# Altium schematic sheet pca10040_sheet5_buttons_and_leds.SchDoc: PCA10040 - Buttons and LEDs
size A4; Organization: Nordic Semiconductor; DocumentNumber: 5; Revision: 1.2.1; SheetNumber: 5; SheetTotal: 7; CompanyName: Nordic Semiconductor; DrawnBy: KJP/RUBR; ProjectNumber: 4397; PCBRevision: 0256RUBR; DocumentSize: A4; PCAName: PCA10040; PCBNumber: 400150; ProjectName: Quark
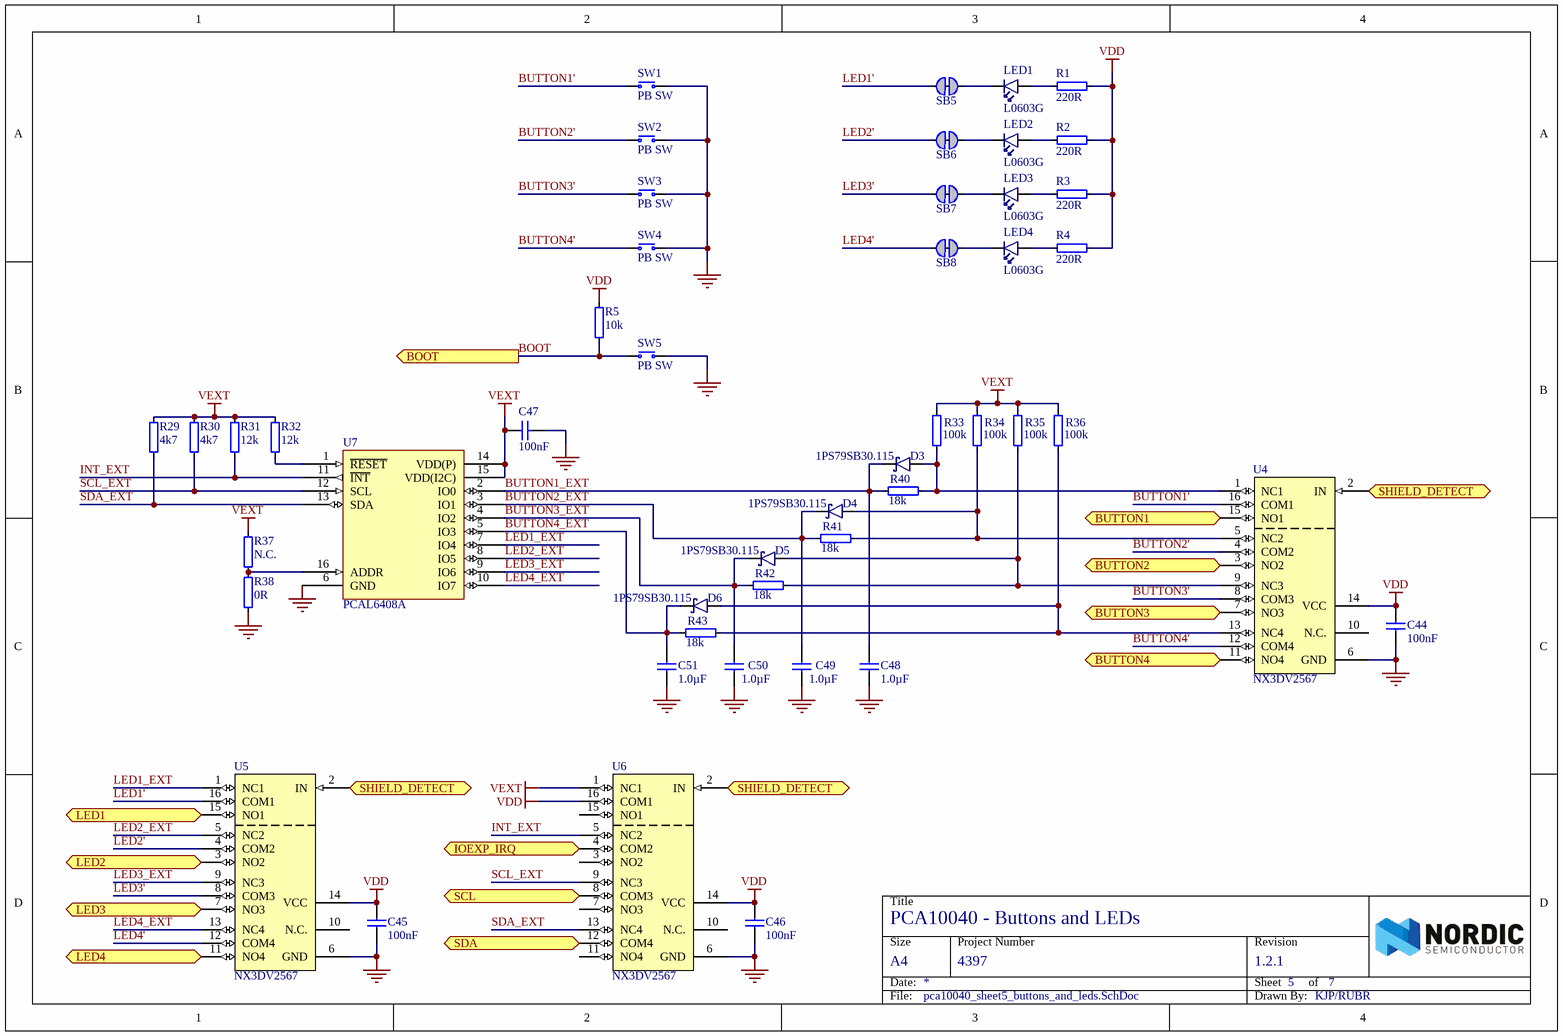
[diagram p0: pca10040_sheet5_buttons_and_leds.SchDoc]

## Parts
C44  100nF  [CAPC1005X04L]
C45  100nF  [CAPC1005X04L]
C46  100nF  [CAPC1005X04L]
C47  100nF  [CAPC1005X04L]
C48  1.0µF  [CAPC1005X04L]
C49  1.0µF  [CAPC1005X04L]
C50  1.0µF  [CAPC1005X04L]
C51  1.0µF  [CAPC1005X04L]
D3  1PS79SB30.115  [SOD-523]
D4  1PS79SB30.115  [SOD-523]
D5  1PS79SB30.115  [SOD-523]
D6  1PS79SB30.115  [SOD-523]
LED1  L0603G  [LED_0603_G]
LED2  L0603G  [LED_0603_G]
LED3  L0603G  [LED_0603_G]
LED4  L0603G  [LED_0603_G]
R1  220R  [RESC1005X04L]
R2  220R  [RESC1005X04L]
R3  220R  [RESC1005X04L]
R4  220R  [RESC1005X04L]
R5  10k  [RESC1005X04L]
R29  4k7  [RESC1005X04L]
R30  4k7  [RESC1005X04L]
R31  12k  [RESC1005X04L]
R32  12k  [RESC1005X04L]
R33  100k  [RESC1005X04L]
R34  100k  [RESC1005X04L]
R35  100k  [RESC1005X04L]
R36  100k  [RESC1005X04L]
R37  N.C.  [RESC1005X04L]
R38  0R  [RESC1005X04L]
R40  18k  [RESC1005X04L]
R41  18k  [RESC1005X04L]
R42  18k  [RESC1005X04L]
R43  18k  [RESC1005X04L]
SB5  Solderbridge  [Solderbridge_Shorted]  (value not drawn)  (net tie, no BOM)
SB6  Solderbridge  [Solderbridge_Shorted]  (value not drawn)  (net tie, no BOM)
SB7  Solderbridge  [Solderbridge_Shorted]  (value not drawn)  (net tie, no BOM)
SB8  Solderbridge  [Solderbridge_Shorted]  (value not drawn)  (net tie, no BOM)
SW1  PB SW  [Switch-PB-6.2x6.3mm-SMD]
SW2  PB SW  [Switch-PB-6.2x6.3mm-SMD]
SW3  PB SW  [Switch-PB-6.2x6.3mm-SMD]
SW4  PB SW  [Switch-PB-6.2x6.3mm-SMD]
SW5  PB SW  [Switch-PB-6.2x6.3mm-SMD]
U4  NX3DV2567  [XQFN40P180X260X50-16N]
U5  NX3DV2567  [XQFN40P180X260X50-16N]
U6  NX3DV2567  [XQFN40P180X260X50-16N]
U7  PCAL6408A  [XQFN40P180X260X50-16N]

## Ports
BOOT (out), BUTTON1 (bidir), BUTTON2 (bidir), BUTTON3 (bidir), BUTTON4 (bidir), IOEXP_IRQ (bidir), LED1 (bidir), LED2 (bidir), LED3 (bidir), LED4 (bidir), SCL (bidir), SDA (bidir), SHIELD_DETECT (in)

## Nets
GND: C44.1 C45.1 C46.1 C47.1 C48.2 C49.1 C50.1 C51.2 R38.1 SW1.1(N.O) SW2.1(N.O) SW3.1(N.O) SW4.1(N.O) SW5.1(N.O) U4.6(GND) U5.6(GND) U6.6(GND) U7.6(GND)
VDD: C44.2 C45.2 C46.2 R1.2 R2.2 R3.2 R4.2 R5.2 U4.14(VCC) U5.14(VCC) U6.14(VCC) U6.16(COM1)
VEXT: C47.2 R29.2 R30.2 R31.2 R32.2 R33.2 R34.2 R35.2 R36.2 R37.2 U6.1(NC1) U7.14(VDD(P)) U7.15(VDD(I2C))
BOOT: R5.1 SW5.2(COM) ; port BOOT
BUTTON1: U4.15(NO1) ; port BUTTON1
BUTTON1': SW1.2(COM) U4.16(COM1)
BUTTON1_EXT: C48.1 D3.3(C) R40.1 U7.2(IO0)
BUTTON2: U4.3(NO2) ; port BUTTON2
BUTTON2': SW2.2(COM) U4.4(COM2)
BUTTON2_EXT: C49.2 D4.3(C) R41.1 U7.3(IO1)
BUTTON3: U4.7(NO3) ; port BUTTON3
BUTTON3': SW3.2(COM) U4.8(COM3)
BUTTON3_EXT: C50.2 D5.3(C) R42.1 U7.4(IO2)
BUTTON4: U4.11(NO4) ; port BUTTON4
BUTTON4': SW4.2(COM) U4.12(COM4)
BUTTON4_EXT: C51.1 D6.3(C) R43.1 U7.5(IO3)
INT_EXT: R31.1 U6.5(NC2) U7.11(~{INT})
IOEXP_IRQ: U6.4(COM2) ; port IOEXP_IRQ
LED1: U5.15(NO1) ; port LED1
LED1': SB5.1 U5.16(COM1)
LED1_EXT: U5.1(NC1) U7.7(IO4)
LED2: U5.3(NO2) ; port LED2
LED2': SB6.1 U5.4(COM2)
LED2_EXT: U5.5(NC2) U7.8(IO5)
LED3: U5.7(NO3) ; port LED3
LED3': SB7.1 U5.8(COM3)
LED3_EXT: U5.9(NC3) U7.9(IO6)
LED4: U5.11(NO4) ; port LED4
LED4': SB8.1 U5.12(COM4)
LED4_EXT: U5.13(NC4) U7.10(IO7)
SCL: U6.8(COM3) ; port SCL
SCL_EXT: R30.1 U6.9(NC3) U7.12(SCL)
SDA: U6.12(COM4) ; port SDA
SDA_EXT: R29.1 U6.13(NC4) U7.13(SDA)
SHIELD_DETECT: U4.2(IN) U5.2(IN) U6.2(IN) ; port SHIELD_DETECT
NetD3_1: D3.1(A) R33.1 R40.2 U4.1(NC1)
NetD4_1: D4.1(A) R34.1 R41.2 U4.5(NC2)
NetD5_1: D5.1(A) R35.1 R42.2 U4.9(NC3)
NetD6_1: D6.1(A) R36.1 R43.2 U4.13(NC4)
NetLED1_1: LED1.1(C) SB5.2
NetLED1_2: LED1.2(A) R1.1
NetLED2_1: LED2.1(C) SB6.2
NetLED2_2: LED2.2(A) R2.1
NetLED3_1: LED3.1(C) SB7.2
NetLED3_2: LED3.2(A) R3.1
NetLED4_1: LED4.1(C) SB8.2
NetLED4_2: LED4.2(A) R4.1
NetR32_1: R32.1 U7.1(~{RESET})
NetR37_1: R37.1 R38.2 U7.16(ADDR)

Not connected (* = marked no-connect by the designer): U4 10(N.C.); U5 10(N.C.); U6 3(NO2) 7(NO3) 10(N.C.) 11(NO4) 15(NO1)

## Notes on the sheet
- Title
- Size
- Date:
- Project Number
- Sheet         of
- Revision
- File:
- Drawn By:

## Library data of the parts
C44-C47 = C0402-100n: Capacitor, X7R, ±10%; Part number IPS: 00000005296; Note: 16V; Artikkelnr Noca: 20039200; Artikkelnr Simpro: N.A.; Part Number: C0402-100n; Manufacturer: *; Manufacturer Part Number: *; Datasheet: *; Footprint Doc: 0402; LatestRevisionDate: 2009-11-23; Pin Count: 2; Publisher: Nordic Semiconductor; Published: 2009-05-08; Value: 100nF; Supplier: *; Supplier part number: *; 2nd source Supplier: *; 2nd source part number: *
C48-C51 = C0402-1µ0: Capacitor, X5R, ±5%; Part number IPS: 00000006569; Note: 6.3V; Artikkelnr Noca: 20039235; Artikkelnr Simpro: N.A.; Part Number: C0402-1µ0; Manufacturer: *; Manufacturer Part Number: *; Datasheet: *; Footprint Doc: 0402; LatestRevisionDate: 2016-08-22; Pin Count: 2; Publisher: Nordic Semiconductor; Published: 2009-05-08; Value: 1.0µF; Supplier: Digi-Key; Supplier part number: 1276-1444-1-ND; 2nd source Supplier: *; 2nd source part number: *
D3-D6 = 1PS79SB30.115: Diode Schottky Vf=0.38, Vr=40V, If=200mA, Ir=500nA; Manufacturer: NXP; 2nd source part number: 873-4097; Artikkelnr Noca: 10029120; Artikkelnr Simpro: N.A.; Part Number: 1PS79SB30.115; Manufacturer Part Number: 1PS79SB30.115; Datasheet: http://www.nxp.com/documents/data_sheet/1PS79SB30.pdf; Footprint Doc: SOD-523; LatestRevisionDate: 2016-08-26; Pin Count: 2; Publisher: Nordic Semiconductor; Published: 2014-09-24; Value: 1PS79SB30.115; Note: *; Supplier: Digi-Key; Supplier part number: 568-5973-1-ND; 2nd source Supplier: Farnell
LED1-LED4 = LG L29K Smartled Green: LED SMARTLED GREEN 570NM 0603; Manufacturer: Osram; Manufacturer Part Number: LG L29K-G2J1-24-Z; 2nd source part number: 720-LGL29KG2J124Z; Note: 2,24..5.6 mcd, Vfmin=1.7V; Artikkelnr Noca: 13019147; Artikkelnr Simpro: N.A.; Part Number: LG L29K Smartled Green; Datasheet: http://www.osram-os.com/Graphics/XPic2/00077107_0.pdf; Footprint Doc: 0603; LatestRevisionDate: 2016-08-26; Pin Count: 2; Publisher: Nordic Semiconductor; Published: 2014-10-28; Value: L0603G; Supplier: Digi-Key; Supplier part number: 475-2709-1-ND; 2nd source Supplier: Mouser
R1-R4 = R0402-220: Resistor, ±1%, 0.063W; Note: Chip Res 1%; Artikkelnr Noca: 27049057; Artikkelnr Simpro: N.A.; Value Ohm: 220; Part Number: R0402-220; Manufacturer: *; Manufacturer Part Number: *; Datasheet: *; LatestRevisionDate: 2009-11-23; Pin Count: 2; Publisher: Nordic Semiconductor; Published: 2009-05-08; Value: 220R; Supplier: Farnell; Supplier part number: 173-8841; 2nd source Supplier: *; 2nd source part number: *; Footprint Doc: 0402
R5 = R0402-10k: Resistor, ±1%, 0.063W; Part number IPS: 00000002093; Note: Chip Res 1%; Artikkelnr Noca: 27049097; Artikkelnr Simpro: N.A.; Value Ohm: 10000; Part Number: R0402-10k; Manufacturer: *; Manufacturer Part Number: *; Datasheet: *; Footprint Doc: 0402; LatestRevisionDate: 2009-11-23; Pin Count: 2; Publisher: Nordic Semiconductor; Published: 2009-05-08; Value: 10k; Supplier: Farnell; Supplier part number: 173-8864; 2nd source Supplier: *; 2nd source part number: *
R29 R30 = R0402-4k7: Resistor, ±1%, 0.063W; Part number IPS: 00000003433; Note: Chip Res 1%; Artikkelnr Noca: 27049089; Artikkelnr Simpro: N.A.; Value Ohm: 4700; Part Number: R0402-4k7; Manufacturer: *; Manufacturer Part Number: *; Datasheet: *; Footprint Doc: 0402; LatestRevisionDate: 2009-11-23; Pin Count: 2; Publisher: Nordic Semiconductor; Published: 2009-05-08; Value: 4k7; Supplier: Farnell; Supplier part number: 173-8858; 2nd source Supplier: *; 2nd source part number: *
R31 R32 = R0402-12k: Resistor, ±1%, 0.063W; Note: Chip Res 1%; Artikkelnr Noca: 27049099; Artikkelnr Simpro: N.A.; Value Ohm: 12000; Part Number: R0402-12k; Manufacturer: *; Manufacturer Part Number: *; Datasheet: *; Footprint Doc: 0402; LatestRevisionDate: 2009-11-23; Pin Count: 2; Publisher: Nordic Semiconductor; Published: 2009-05-08; Value: 12k; Supplier: Farnell; Supplier part number: 173-8865; 2nd source Supplier: *; 2nd source part number: *
R33-R36 = R0402-100k: Resistor, ±1%, 0.063W; Part number IPS: 00000003667; Note: Chip Res 1%; Artikkelnr Noca: 27049121; Artikkelnr Simpro: N.A.; Value Ohm: 100000; Part Number: R0402-100k; Manufacturer: *; Manufacturer Part Number: *; Datasheet: *; Footprint Doc: 0402; LatestRevisionDate: 2009-11-23; Pin Count: 2; Publisher: Nordic Semiconductor; Published: 2009-05-08; Value: 100k; Supplier: Farnell; Supplier part number: 173-8877; 2nd source Supplier: *; 2nd source part number: *
R37 = R0402-N.C.: Not mounted; Note: Chip Res; Artikkelnr Noca: N.A.; Assembly: Not mounted; Part Number: R0402-N.C.; Manufacturer: *; Manufacturer Part Number: *; Datasheet: *; Footprint Doc: 0402; LatestRevisionDate: 2009-05-08; Pin Count: 2; Publisher: Nordic Semiconductor; Published: 2009-05-08; Value: N.C.; Supplier: *; Supplier part number: *; 2nd source Supplier: *; 2nd source part number: *; Artikkelnr Simpro: N.A.
R38 = R0402-0R: Resistor, ±5%, 0.063W; Note: Chip Res 5%; Artikkelnr Noca: 27049000; Artikkelnr Simpro: N.A.; Value Ohm: 0; Part Number: R0402-0R; Manufacturer: *; Manufacturer Part Number: *; Datasheet: *; Footprint Doc: 0402; LatestRevisionDate: 2009-11-23; Pin Count: 2; Publisher: Nordic Semiconductor; Published: 2009-05-08; Value: 0R; Supplier: Farnell; Supplier part number: 146-9661; 2nd source Supplier: *; 2nd source part number: *
R40-R43 = R0402-18k: Resistor, ±1%, 0.063W; Part number IPS: 00000003300; Note: Chip Res 1%; Artikkelnr Noca: 27049103; Artikkelnr Simpro: N.A.; Value Ohm: 18000; Part Number: R0402-18k; Manufacturer: *; Manufacturer Part Number: *; Datasheet: *; Footprint Doc: 0402; LatestRevisionDate: 2009-11-23; Pin Count: 2; Publisher: Nordic Semiconductor; Published: 2009-05-08; Value: 18k; Supplier: Farnell; Supplier part number: 173-8867; 2nd source Supplier: *; 2nd source part number: *
SB5-SB8 = Solderbridge Shorted: Shorted Solderbridge; Artikkelnr Noca: N.A.; Part Number: Solderbridge Shorted; Manufacturer: *; Manufacturer Part Number: *; Datasheet: *; LatestRevisionDate: 2012-08-07; Pin Count: 2; Publisher: Nordic Semiconductor; Published: 2012-08-07; Value: Solderbridge; Note: *; Supplier: *; Supplier part number: *; 2nd source Supplier: *; 2nd source part number: *; Footprint Doc: Solderbridge_Shorted; Artikkelnr Simpro: N.A.
SW1-SW5 = Switch-PB-6.2x6.3mm-SMD: Tactile Switch, SPNO, SMD, 160gf, 6.2x6.3x2.5mm; Manufacturer: Dailywell; Manufacturer Part Number: TS604VM1-025BR-R; 2nd source part number: 688-SKHUALE010; Artikkelnr Noca: 50019106; Artikkelnr Simpro: N.A.; Part Number: Switch-PB-6.2x6.3mm-SMD; Datasheet: \\hizz\pro\app9717\Datasheet\switches\Dailywell\TS604VM1-025BR-R.pdf; Footprint Doc: Switch-PB-6.2x6.3mm-SMD; LatestRevisionDate: 2016-04-21; Pin Count: 4; Publisher: Nordic Semiconductor; Published: 2010-02-01; Value: PB SW; Note: *; Supplier: Cabcon; Supplier part number: TS604VM1-025BR-R; 2nd source Supplier: Mouser
U4-U6 = NX3DV2567GU: Low-ohmic four-pole double-throw analog switch; Manufacturer: NXP Semiconductors; 2nd source part number: 771-NX3DV2567GU115; Artikkelnr Noca: 15079317; Artikkelnr Simpro: N.A.; Part Number: NX3DV2567GU; Manufacturer Part Number: NX3DV2567GU; Datasheet: http://www.nxp.com/documents/data_sheet/NX3DV2567.pdf; Footprint Doc: XQFN-16; LatestRevisionDate: 2015-02-17; Pin Count: 16; Publisher: Nordic Semiconductor; Published: 2015-02-17; Value: NX3DV2567; Note: *; Supplier: Digi-Key; Supplier part number: 568-5206-1-ND; 2nd source Supplier: Mouser
U7 = PCAL6408AHK: 8-bit I2C-bus I/O expander with interrupt output; Manufacturer: NXP Semiconductors; 2nd source part number: 771-PCAL6408AHKX; Artikkelnr Noca: 15079321; Artikkelnr Simpro: N.A.; Part Number: PCAL6408AHK; Manufacturer Part Number: PCAL6408AHK; Datasheet: http://www.nxp.com/documents/data_sheet/PCAL6408A.pdf; Footprint Doc: XQFN-16; LatestRevisionDate: 2015-04-29; Pin Count: 16; Publisher: Nordic Semiconductor; Published: 2015-04-29; Value: PCAL6408A; Note: *; Supplier: Digi-Key; Supplier part number: 568-9944-1-ND; 2nd source Supplier: Mouser